# EAGLE schematic team build full layout (EAGLE 9.6.2)
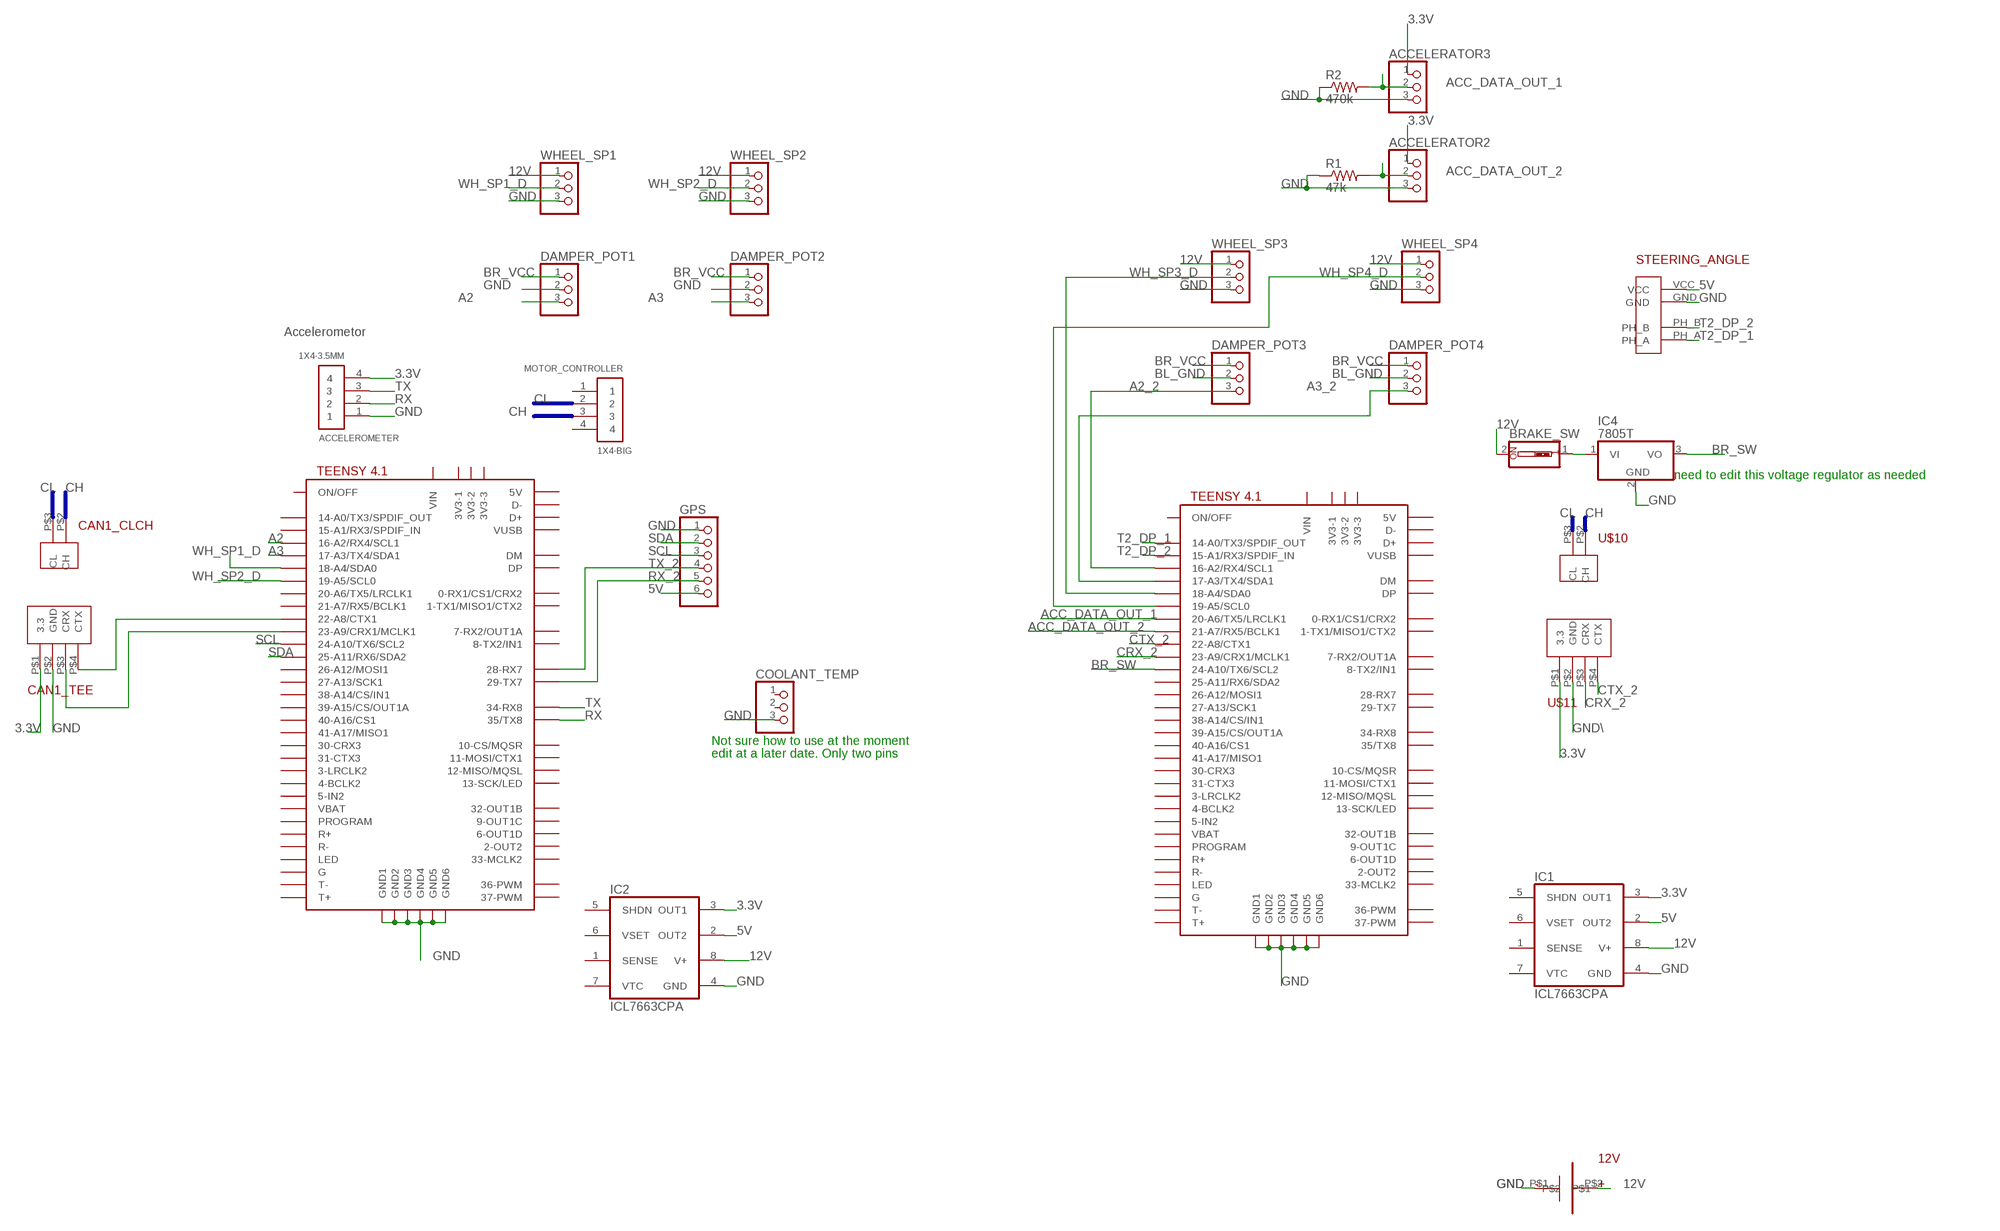
[diagram p0: schematic, sheet 1, part 1 of 2]
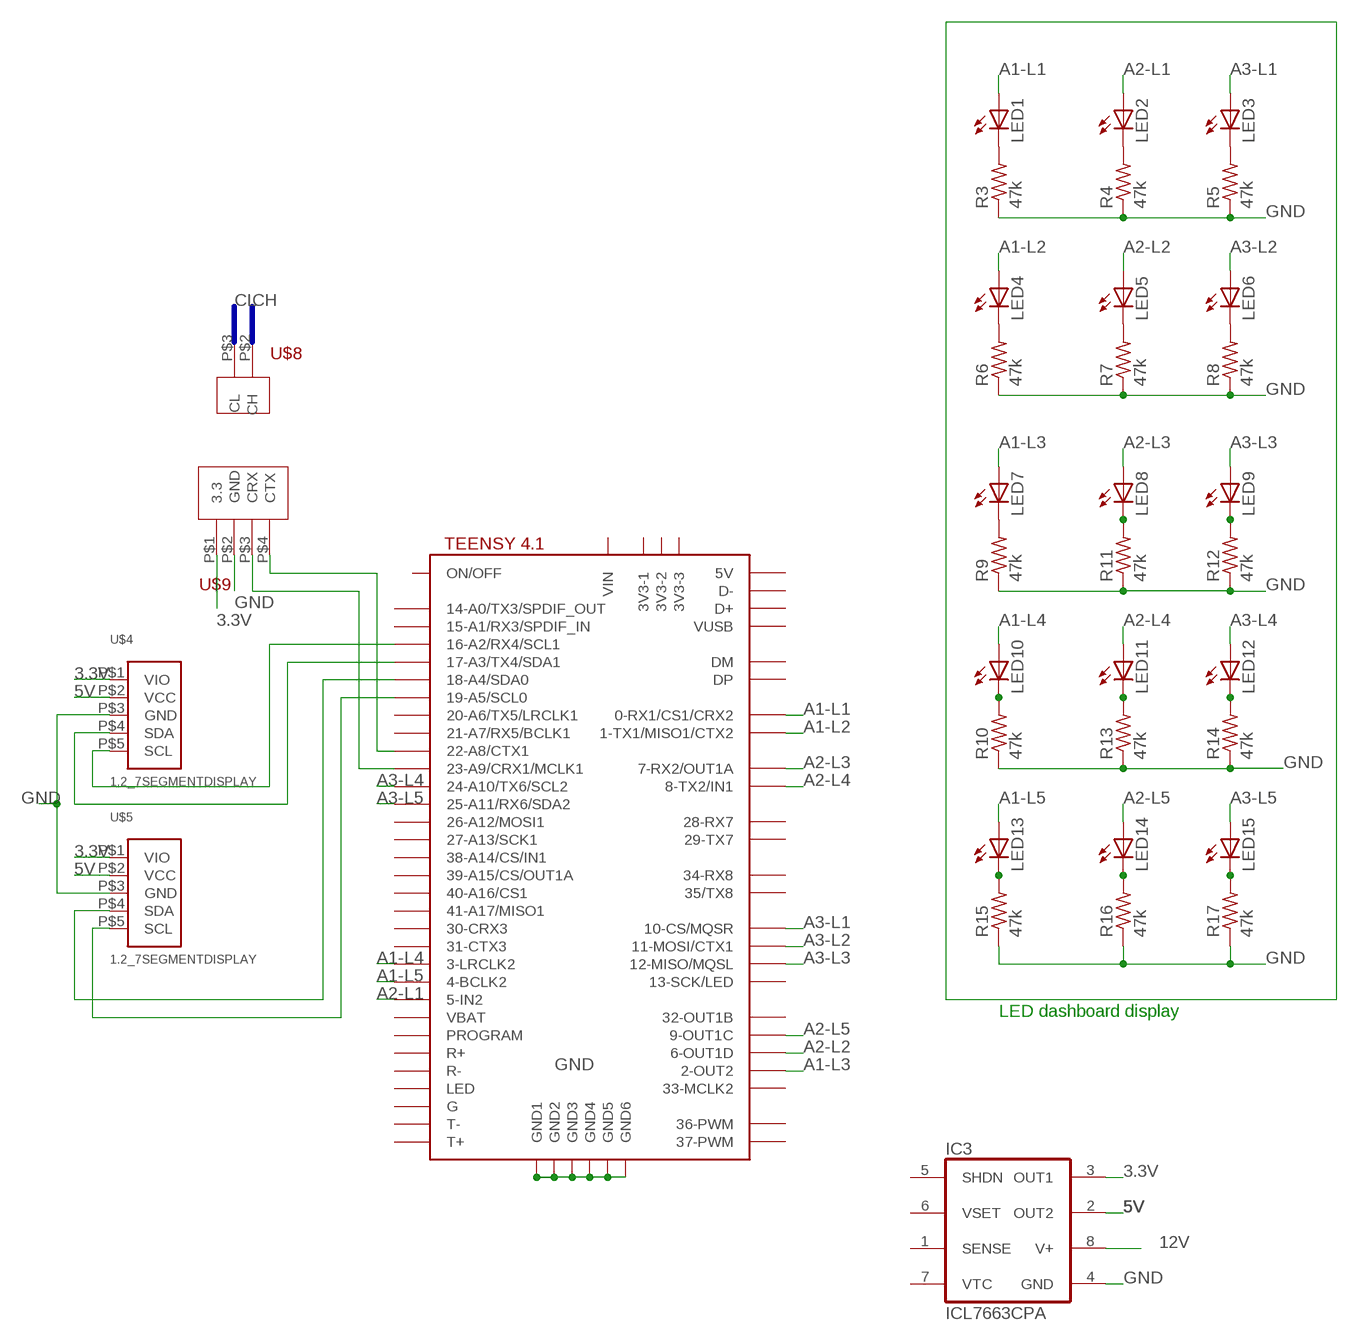
[diagram p1: schematic, sheet 1, part 2 of 2]

## Parts
12V  PWD_12  [PWD_12]
ACCELERATOR2  PINHD-1X3  [1X03]
ACCELERATOR3  PINHD-1X3  [1X03]
ACCELEROMETER  1X4-3.5MM  [1X04-3.5MM]
BRAKE_SW  SW_DIP-1  [EDG-01]
CAN1_CLCH  CAN_BUS  [CAN_BUS]
CAN1_TEE  CAN_TEE  [CAN_TEN]
COOLANT_TEMP  PINHD-1X3  [1X03]
DAMPER_POT1  PINHD-1X3CB  [1X03-CLEANBIG]
DAMPER_POT2  PINHD-1X3CB  [1X03-CLEANBIG]
DAMPER_POT3  PINHD-1X3CB  [1X03-CLEANBIG]
DAMPER_POT4  PINHD-1X3CB  [1X03-CLEANBIG]
GPS  PINHD-1X6-3.5MM  [1X06-3.5MM]
IC1  ICL7663CPA  [DIL08]
IC2  ICL7663CPA  [DIL08]
IC3  ICL7663CPA  [DIL08]
IC4  7805T  [TO220H]
LED1  LED3MM  [LED3MM]
LED2  LED3MM  [LED3MM]
LED3  LED3MM  [LED3MM]
LED4  LED3MM  [LED3MM]
LED5  LED3MM  [LED3MM]
LED6  LED3MM  [LED3MM]
LED7  LED3MM  [LED3MM]
LED8  LED3MM  [LED3MM]
LED9  LED3MM  [LED3MM]
LED10  LED3MM  [LED3MM]
LED11  LED3MM  [LED3MM]
LED12  LED3MM  [LED3MM]
LED13  LED3MM  [LED3MM]
LED14  LED3MM  [LED3MM]
LED15  LED3MM  [LED3MM]
MOTOR_CONTROLLER  1X4-BIG  [1X04-BIG]
R1  47k  R-US_0204/7  [0204/7]
R2  470k  R-US_0204/7  [0204/7]
R3  47k  R-US_0204/7  [0204/7]
R4  47k  R-US_0204/7  [0204/7]
R5  47k  R-US_0204/7  [0204/7]
R6  47k  R-US_0204/7  [0204/7]
R7  47k  R-US_0204/7  [0204/7]
R8  47k  R-US_0204/7  [0204/7]
R9  47k  R-US_0204/7  [0204/7]
R10  47k  R-US_0204/7  [0204/7]
R11  47k  R-US_0204/7  [0204/7]
R12  47k  R-US_0204/7  [0204/7]
R13  47k  R-US_0204/7  [0204/7]
R14  47k  R-US_0204/7  [0204/7]
R15  47k  R-US_0204/7  [0204/7]
R16  47k  R-US_0204/7  [0204/7]
R17  47k  R-US_0204/7  [0204/7]
STEERING_ANGLE  ROTARY_ENCODER  [ROTARY_ENCODER]
U$1  TEENSY41  [TEENSY41]
U$2  TEENSY41  [TEENSY41]
U$3  TEENSY41  [TEENSY41]
U$4  1.2_7SEGMENTDISPLAY  [5IL]
U$5  1.2_7SEGMENTDISPLAY  [5IL]
U$6  CAN_BUS  [CAN_BUS]  (not placed on a sheet)
U$7  CAN_BUS  [CAN_BUS]  (not placed on a sheet)
U$8  CAN_BUS  [CAN_BUS]
U$9  CAN_TEE  [CAN_TEN]
U$10  CAN_BUS  [CAN_BUS]
U$11  CAN_TEE  [CAN_TEN]
WHEEL_SP1  PINHD-1X3  [1X03]
WHEEL_SP2  PINHD-1X3  [1X03]
WHEEL_SP3  PINHD-1X3  [1X03]
WHEEL_SP4  PINHD-1X3  [1X03]

## Nets
3.3V: ACCELERATOR2.1 ACCELERATOR3.1 ACCELEROMETER.4 CAN1_TEE.P$1(3.3) IC1.3(OUT1) IC2.3(OUT1) IC3.3(OUT1) U$4.P$1(VIO) U$5.P$1(VIO) U$9.P$1(3.3) U$11.P$1(3.3)
5V: GPS.6 IC1.2(OUT2) IC2.2(OUT2) IC3.2(OUT2) STEERING_ANGLE.VCC U$4.P$2(VCC) U$5.P$2(VCC)
12V: 12V.P$2 BRAKE_SW.2 IC1.8(V+) IC2.8(V+) IC3.8(V+) WHEEL_SP1.1 WHEEL_SP2.1 WHEEL_SP3.1 WHEEL_SP4.1
A1-L1: LED1.A U$2.0-RX1/CS1/CRX2
A1-L2: LED4.A U$2.1-TX1/MISO1/CTX2
A1-L3: LED7.A U$2.2-OUT2
A1-L4: LED10.A U$2.3-LRCLK2
A1-L5: LED13.A U$2.4-BCLK2
A2: DAMPER_POT1.3 U$1.16-A2/RX4/SCL1
A2-L1: LED2.A U$2.5-IN2
A2-L2: LED5.A U$2.6-OUT1D
A2-L3: LED8.A U$2.7-RX2/OUT1A
A2-L4: LED11.A U$2.8-TX2/IN2(8-TX2/IN1)
A2-L5: LED14.A U$2.9-OUT1C
A2_2: DAMPER_POT3.3 U$3.16-A2/RX4/SCL1
A3: DAMPER_POT2.3 U$1.17-A3/TX4/SDA1
A3-L1: LED3.A U$2.10-CS\MQSR(10-CS/MQSR)
A3-L2: LED6.A U$2.11-MOSI/CTX1
A3-L3: LED9.A U$2.12-MISO/MQSL
A3-L4: LED12.A U$2.24-A10/TX6/SCL2
A3-L5: LED15.A U$2.25-A11/RX6/SDA2
A3_2: DAMPER_POT4.3 U$3.17-A3/TX4/SDA1
ACC_DATA_OUT_1: ACCELERATOR3.2 R2.2 U$3.20-A6/TX5/LRCLK1
ACC_DATA_OUT_2: ACCELERATOR2.2 R1.2 U$3.21-A7/RX5/BCLK1
BL_GND: DAMPER_POT3.2 DAMPER_POT4.2
BR_SW: IC4.3(VO) U$3.24-A10/TX6/SCL2
BR_VCC: DAMPER_POT1.1 DAMPER_POT2.1 DAMPER_POT3.1 DAMPER_POT4.1
CRX_2: U$3.23-A9/CRX1/MCLK1 U$11.P$3(CRX)
CTX_2: U$3.22-A8/CTX1 U$11.P$4(CTX)
GND: 12V.P$1 ACCELERATOR2.3 ACCELERATOR3.3 ACCELEROMETER.1 CAN1_TEE.P$2(GND) COOLANT_TEMP.3 DAMPER_POT1.2 DAMPER_POT2.2 GPS.1 IC1.4(GND) IC2.4(GND) IC3.4(GND) IC4.2(GND) R1.1 R2.1 R3.1 R4.1 R5.1 R6.1 R7.1 R8.1 R9.1 R10.1 R11.1 R12.1 R13.1 R14.1 R15.1 R16.1 R17.1 STEERING_ANGLE.GND U$1.GND1 U$1.GND2 U$1.GND3 U$1.GND4 U$1.GND5 U$1.GND6 U$2.GND1 U$2.GND2 U$2.GND3 U$2.GND4 U$2.GND5 U$2.GND6 U$3.GND1 U$3.GND2 U$3.GND3 U$3.GND4 U$3.GND5 U$3.GND6 U$4.P$3(GND) U$5.P$3(GND) U$9.P$2(GND) WHEEL_SP1.3 WHEEL_SP2.3 WHEEL_SP3.3 WHEEL_SP4.3
GND\: U$11.P$2(GND)
N$2: CAN1_TEE.P$3(CRX) U$1.23-A9/CRX1/MCLK1
N$3: CAN1_TEE.P$4(CTX) U$1.22-A8/CTX1
N$4: BRAKE_SW.1 IC4.1(VI)
N$6: U$2.17-A3/TX4/SDA1 U$4.P$4(SDA)
N$7: U$2.16-A2/RX4/SCL1 U$4.P$5(SCL)
N$8: U$2.18-A4/SDA0 U$5.P$4(SDA)
N$9: U$2.19-A5/SCL0 U$5.P$5(SCL)
N$10: LED1.K(C) R3.2
N$11: LED2.K(C) R4.2
N$12: U$2.22-A8/CTX1 U$9.P$4(CTX)
N$13: U$2.23-A9/CRX1/MCLK1 U$9.P$3(CRX)
N$14: LED3.K(C) R5.2
N$15: LED4.K(C) R6.2
N$16: LED5.K(C) R7.2
N$17: LED6.K(C) R8.2
N$18: LED7.K(C) R9.2
N$19: LED10.K(C) R10.2
N$20: LED8.K(C) R11.2
N$21: LED9.K(C) R12.2
N$22: LED11.K(C) R13.2
N$23: LED12.K(C) R14.2
N$24: LED13.K(C) R15.2
N$25: LED14.K(C) R16.2
N$26: LED15.K(C) R17.2
RX: ACCELEROMETER.2 U$1.35-TX8(35/TX8)
RX_2: GPS.5 U$1.29-TX7
SCL: GPS.3 U$1.24-A10/TX6/SCL2
SDA: GPS.2 U$1.25-A11/RX6/SDA2
T2_DP_1: STEERING_ANGLE.PH_A U$3.14-A0/TX3/SPDIF_OUT
T2_DP_2: STEERING_ANGLE.PH_B U$3.15-A1/RX3/SPDIF_IN
TX: ACCELEROMETER.3 U$1.34-RX8
TX_2: GPS.4 U$1.28-RX7
WH_SP1_D: U$1.18-A4/SDA0 WHEEL_SP1.2
WH_SP2_D: U$1.19-A5/SCL0 WHEEL_SP2.2
WH_SP3_D: U$3.18-A4/SDA0 WHEEL_SP3.2
WH_SP4_D: U$3.19-A5/SCL0 WHEEL_SP4.2
Unconnected: CAN1_CLCH.P$2(CH) CAN1_CLCH.P$3(CL) COOLANT_TEMP.1 COOLANT_TEMP.2 IC1.1(SENSE) IC1.5(SHDN) IC1.6(VSET) IC1.7(VTC) IC2.1(SENSE) IC2.5(SHDN) IC2.6(VSET) IC2.7(VTC) IC3.1(SENSE) IC3.5(SHDN) IC3.6(VSET) IC3.7(VTC) MOTOR_CONTROLLER.1 MOTOR_CONTROLLER.2 MOTOR_CONTROLLER.3 MOTOR_CONTROLLER.4 U$1.0-RX1/CS1/CRX2 U$1.1-TX1/MISO1/CTX2 U$1.2-OUT2 U$1.3-LRCLK2 U$1.3V3-1 U$1.3V3-2 U$1.3V3-3 U$1.4-BCLK2 U$1.5-IN2 U$1.6-OUT1D U$1.7-RX2/OUT1A U$1.8-TX2/IN2(8-TX2/IN1) U$1.9-OUT1C U$1.10-CS\MQSR(10-CS/MQSR) U$1.11-MOSI/CTX1 U$1.12-MISO/MQSL U$1.13-SCK/LED U$1.14-A0/TX3/SPDIF_OUT U$1.15-A1/RX3/SPDIF_IN U$1.20-A6/TX5/LRCLK1 U$1.21-A7/RX5/BCLK1 U$1.26-A12/MOSI1 U$1.27-A13/SCK1 U$1.30-CRX3 U$1.31-CTX3 U$1.32-OUT1B U$1.33-MCLK2 U$1.36-PWM U$1.37-PWM U$1.38-A14/CS/IN1 U$1.39-A15/CS/OUT1A U$1.40-A16/CS1 U$1.41-A17/MISO1 U$1.+5V(5V) U$1.D+ U$1.D- U$1.DM U$1.DP U$1.G U$1.LED U$1.ON/OFF U$1.PROGRAM U$1.R+ U$1.R- U$1.T+ U$1.T- U$1.VBAT U$1.VIN U$1.VUSB U$2.3V3-1 U$2.3V3-2 U$2.3V3-3 U$2.13-SCK/LED U$2.14-A0/TX3/SPDIF_OUT U$2.15-A1/RX3/SPDIF_IN U$2.20-A6/TX5/LRCLK1 U$2.21-A7/RX5/BCLK1 U$2.26-A12/MOSI1 U$2.27-A13/SCK1 U$2.28-RX7 U$2.29-TX7 U$2.30-CRX3 U$2.31-CTX3 U$2.32-OUT1B U$2.33-MCLK2 U$2.34-RX8 U$2.35-TX8(35/TX8) U$2.36-PWM U$2.37-PWM U$2.38-A14/CS/IN1 U$2.39-A15/CS/OUT1A U$2.40-A16/CS1 U$2.41-A17/MISO1 U$2.+5V(5V) U$2.D+ U$2.D- U$2.DM U$2.DP U$2.G U$2.LED U$2.ON/OFF U$2.PROGRAM U$2.R+ U$2.R- U$2.T+ U$2.T- U$2.VBAT U$2.VIN U$2.VUSB U$3.0-RX1/CS1/CRX2 U$3.1-TX1/MISO1/CTX2 U$3.2-OUT2 U$3.3-LRCLK2 U$3.3V3-1 U$3.3V3-2 U$3.3V3-3 U$3.4-BCLK2 U$3.5-IN2 U$3.6-OUT1D U$3.7-RX2/OUT1A U$3.8-TX2/IN2(8-TX2/IN1) U$3.9-OUT1C U$3.10-CS\MQSR(10-CS/MQSR) U$3.11-MOSI/CTX1 U$3.12-MISO/MQSL U$3.13-SCK/LED U$3.25-A11/RX6/SDA2 U$3.26-A12/MOSI1 U$3.27-A13/SCK1 U$3.28-RX7 U$3.29-TX7 U$3.30-CRX3 U$3.31-CTX3 U$3.32-OUT1B U$3.33-MCLK2 U$3.34-RX8 U$3.35-TX8(35/TX8) U$3.36-PWM U$3.37-PWM U$3.38-A14/CS/IN1 U$3.39-A15/CS/OUT1A U$3.40-A16/CS1 U$3.41-A17/MISO1 U$3.+5V(5V) U$3.D+ U$3.D- U$3.DM U$3.DP U$3.G U$3.LED U$3.ON/OFF U$3.PROGRAM U$3.R+ U$3.R- U$3.T+ U$3.T- U$3.VBAT U$3.VIN U$3.VUSB U$6.P$2(CH) U$6.P$3(CL) U$7.P$2(CH) U$7.P$3(CL) U$8.P$2(CH) U$8.P$3(CL) U$10.P$2(CH) U$10.P$3(CL)

## Buses
CL
CH

## Notes on the sheet
- need to edit this voltage regulator as needed
- Not sure how to use at the moment
- edit at a later date. Only two pins
- LED dashboard display

## Library data of the parts
12V = F-E library custom components:PWD_12
ACCELERATOR2 ACCELERATOR3 COOLANT_TEMP DAMPER_POT1-DAMPER_POT4 WHEEL_SP1-WHEEL_SP4 = adafruit:PINHD-1X3: PIN HEADER
ACCELEROMETER = adafruit:1X4: 4-pin connector; AC: Accelerometor
BRAKE_SW = special:SW_DIP-1: DIP SWITCH
CAN1_CLCH U$6-U$8 U$10 = F-E library custom components:CAN_BUS
CAN1_TEE U$9 U$11 = F-E library custom components:CAN_TEE
GPS = adafruit:PINHD-1X6: PIN HEADER
IC1-IC3 = maxim:ICL7663CPA: Positive VOLTAGE REGULATOR; OC_FARNELL: unknown; OC_NEWARK: unknown
IC4 = adafruit:78*: Positive VOLTAGE REGULATOR Added bigger pads to the TO-92 package
LED1-LED15 = adafruit:LED: LED OSRAM: - CHIPLED LG R971, LG N971, LY N971, LG Q971, LY Q971, LO R971, LY R971 LH N974, LH R974 LS Q976, LO Q976, LY Q976 LO Q996 - Hyper CHIPLED LW Q18S LB Q993, LB Q99A, LB R99A - SideLED LS A670, LO A670, LY A670, LG A670, LP A670 LB A673, LV A673, LT A673, LW A673 LH A674 LY A675 LS A676, LA A676, LO A676, LY A676, LW A676 LS A679, LY A679, LG A679 - Hyper Micro SIDELED® LS Y876, LA Y876, LO Y876, LY Y876 LT Y87S - SmartLED LW L88C, LW L88S LB L89C, LB L89S, LG L890 LS L89K, LO L89K, LY L89K LS L896, LA L896, LO L896, LY L896 - TOPLED LS T670, LO T670, LY T670, LG T670, LP T670 LSG T670, LSP T670, LSY T670, LOP T670, LYG T670 LG T671, LOG T671, LSG T671 LB T673, LV T673, LT T673, LW T673 LH T674 LS T676, LA T676, LO T676, LY T676, LB T676, LH T676, LSB T676, LW T676 LB T67C, LV T67C, LT T67C, LS T67K, LO T67K, LY T67K, LW E67C LS E67B, LA E67B, LO E67B, LY E67B, LB E67C, LV E67C, LT E67C LW T67C LS T679, LY T679, LG T679 LS T770, LO T770, LY T770, LG T770, LP T770 LB T773, LV T773, LT T773, LW T773 LH T774 LS E675, LA E675, LY E675, LS T675 LS T776, LA T776, LO T776, LY T776, LB T776 LHGB T686 LT T68C, LB T68C - Hyper Mini TOPLED® LB M676 - Mini TOPLED Santana® LG M470 LS M47K, LO M47K, LY M47K Source: http://www.osram.convergy.de/
MOTOR_CONTROLLER = adafruit:1X4: 4-pin connector
R1-R17 = rcl:R-US_: RESISTOR, American symbol; SPICEPREFIX: R
STEERING_ANGLE = F-E library custom components:ROTARY_ENCODER
U$1-U$3 = teensy:TEENSY41
U$4 U$5 = David_Pinlayouts:1.2_7SEGMENTDISPLAY